# Altium schematic sheet Functional Diagram.SchDoc: =ProjectName
size A3; Author: Hena Chernov; CompanyName: Catcatcat Electronics; Engineer: Hena Chernov; SheetNumber: 5; SheetTotal: 10; CodePhone: +380505759863; SheetDescription: Project flowchart.; Email: catcatcat.electronics@gmail.com
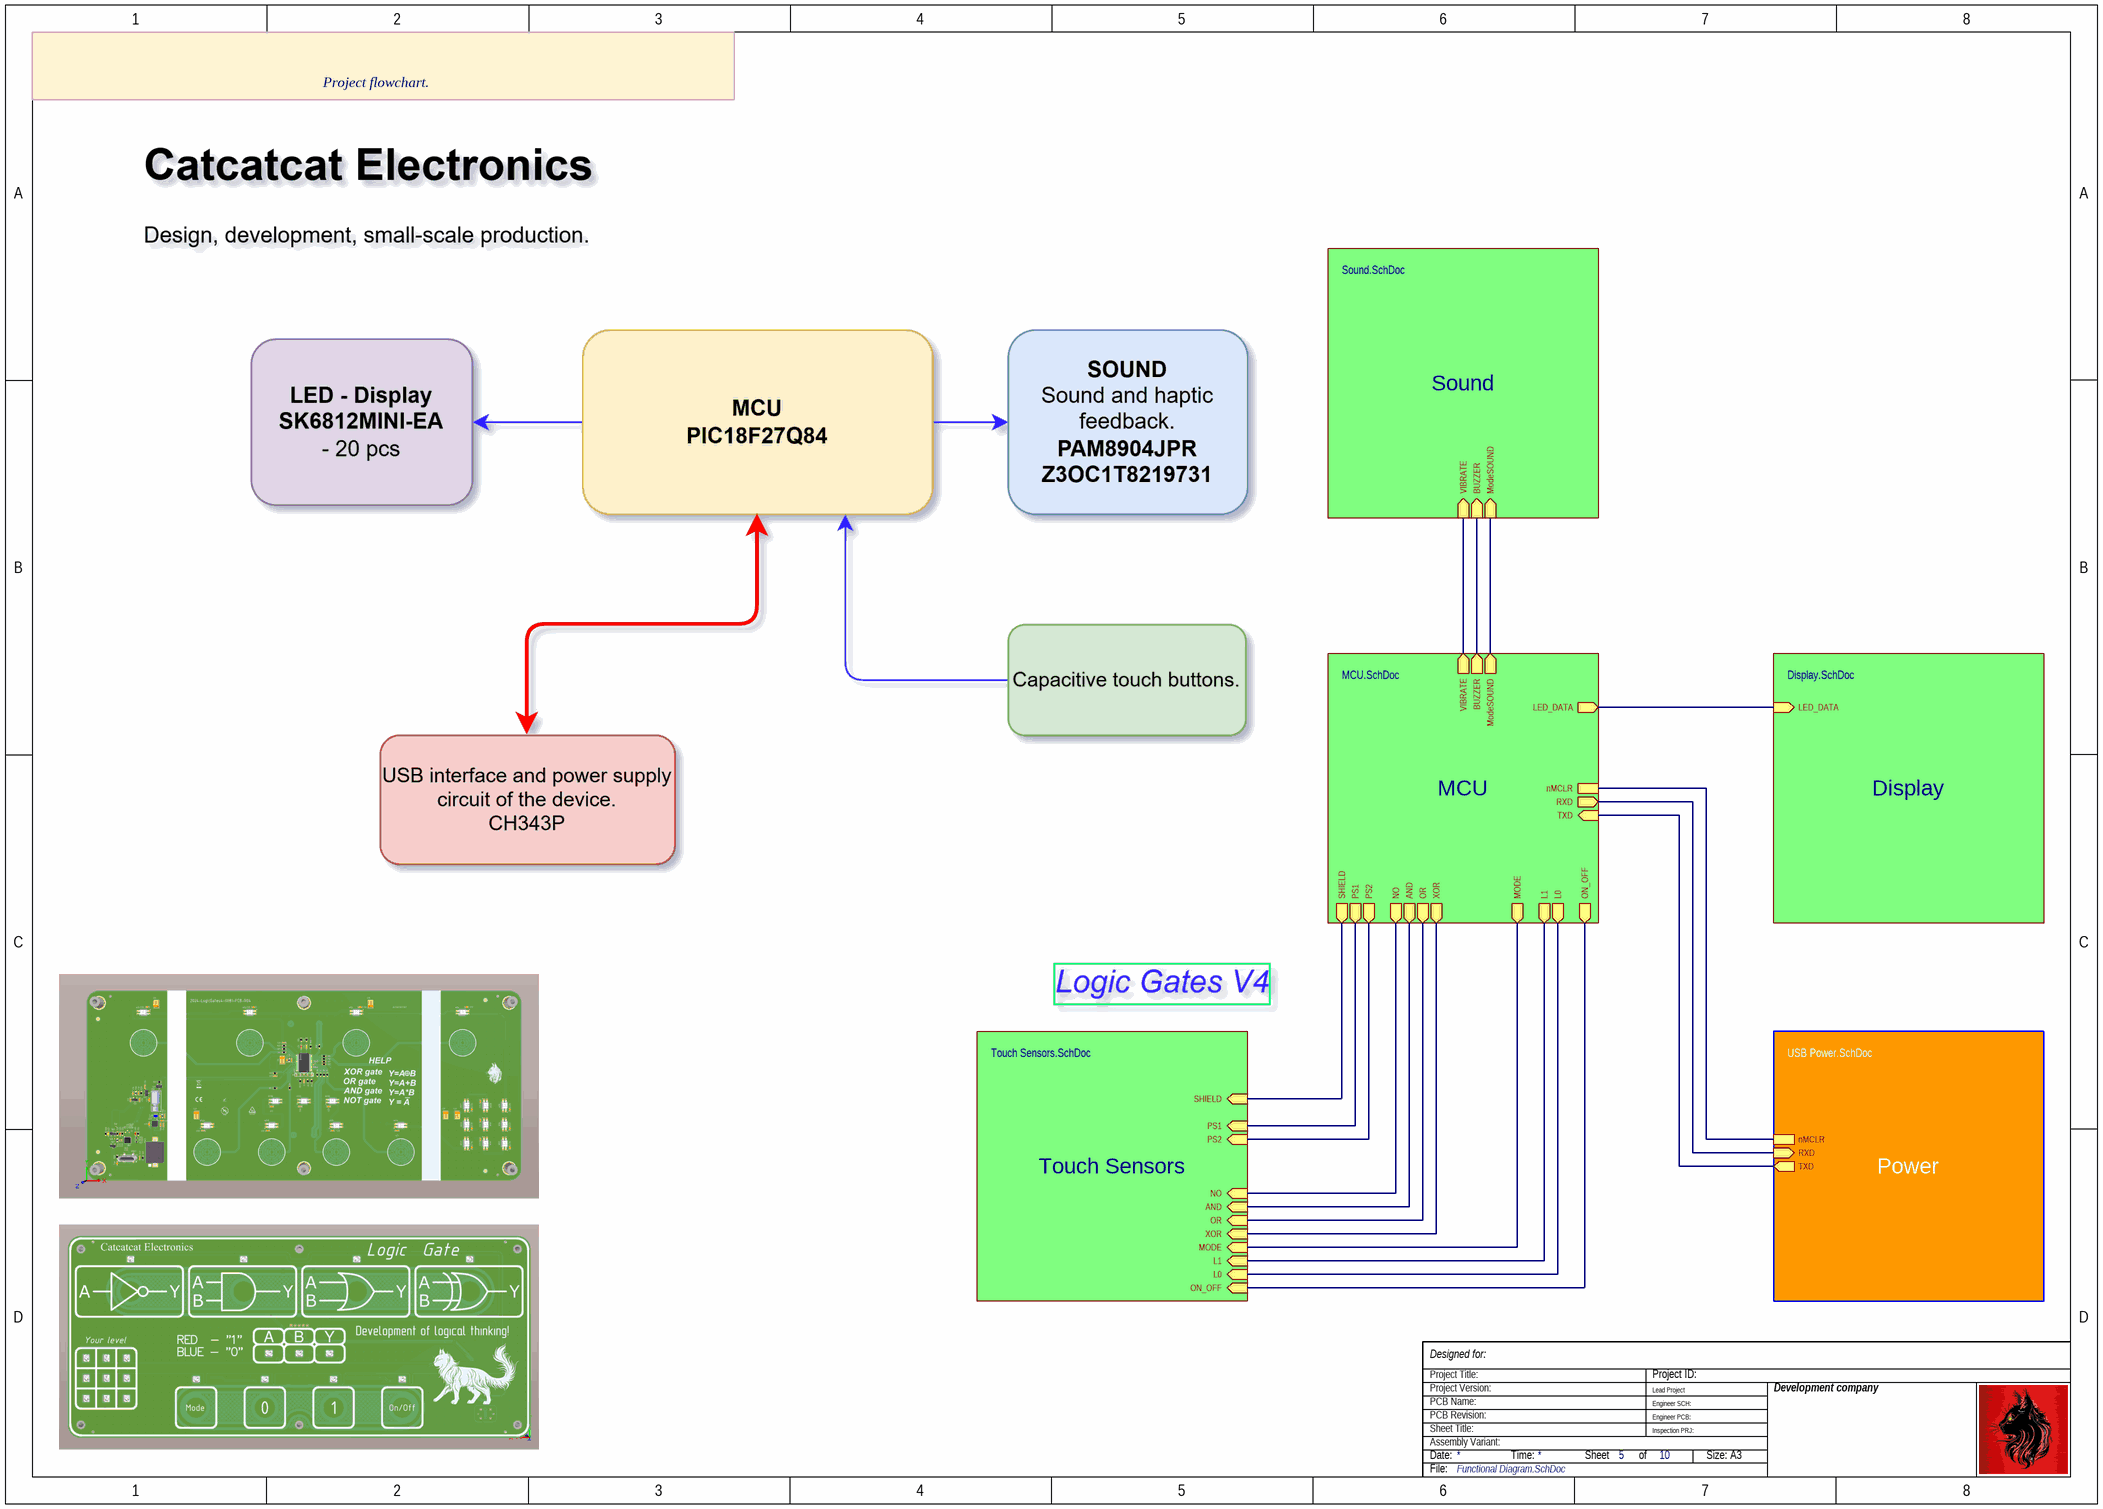
[diagram p0: Functional Diagram.SchDoc]

## Sub-sheets
Display = Display.SchDoc: LED_DATA (in)
MCU = MCU.SchDoc: BUZZER (out), VIBRATE (out), LED_DATA (out), NO (out), AND (out), OR (out), XOR (out), MODE (out), L1 (out), L0 (out), ON_OFF (out), SHIELD (out), PS1 (out), PS2 (out), ModeSOUND (out), nMCLR, RXD (out), TXD (in)
Power = USB Power.SchDoc: RXD (in), nMCLR, TXD (out)
Sound = Sound.SchDoc: BUZZER (in), VIBRATE (in), ModeSOUND (in)
Touch Sensors = Touch Sensors.SchDoc: NO (in), AND (in), OR (in), XOR (in), MODE (in), L1 (in), L0 (in), ON_OFF (in), SHIELD (in), PS1 (in), PS2 (in)

## Nets
(unnamed): sheet Display/LED_DATA, sheet MCU/LED_DATA
(unnamed): sheet MCU/BUZZER, sheet Sound/BUZZER
(unnamed): sheet MCU/VIBRATE, sheet Sound/VIBRATE
(unnamed): sheet MCU/NO, sheet Touch Sensors/NO
(unnamed): sheet MCU/AND, sheet Touch Sensors/AND
(unnamed): sheet MCU/OR, sheet Touch Sensors/OR
(unnamed): sheet MCU/XOR, sheet Touch Sensors/XOR
(unnamed): sheet MCU/MODE, sheet Touch Sensors/MODE
(unnamed): sheet MCU/L1, sheet Touch Sensors/L1
(unnamed): sheet MCU/L0, sheet Touch Sensors/L0
(unnamed): sheet MCU/ON_OFF, sheet Touch Sensors/ON_OFF
(unnamed): sheet MCU/SHIELD, sheet Touch Sensors/SHIELD
(unnamed): sheet MCU/PS1, sheet Touch Sensors/PS1
(unnamed): sheet MCU/PS2, sheet Touch Sensors/PS2
(unnamed): sheet MCU/ModeSOUND, sheet Sound/ModeSOUND
(unnamed): sheet MCU/nMCLR, sheet Power/nMCLR
(unnamed): sheet MCU/RXD, sheet Power/RXD
(unnamed): sheet MCU/TXD, sheet Power/TXD

## Notes on the sheet
- Project Title:
- Project Version:
- Designed for:
- Lead Project
- Project ID:
- Development company
- Date:
- PCB Revision:
- PCB Name:
- Sheet Title:
- Assembly Variant:
- Time:
- Sheet
- of
- Engineer SCH:
- Engineer PCB:
- Inspection PRJ:
- Size: A3
- File: